# Altium schematic sheet Breakout.SchDoc
size A4; DocumentNumber: 1; SheetNumber: 1
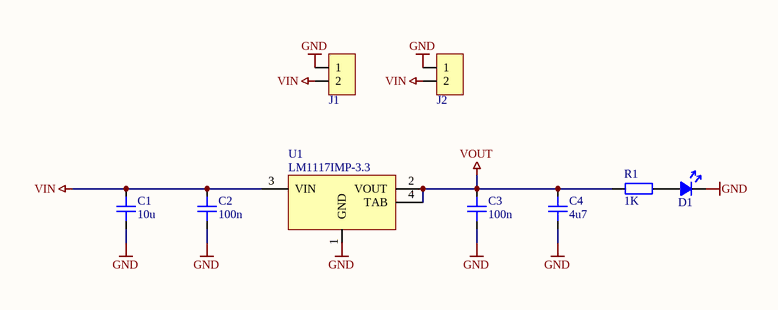
[diagram p0: Breakout.SchDoc]

## Parts
C1  10u  [0805C_RF_M]
C2  100n  [0805C_RF_M]
C3  100n  [0805C_RF_M]
C4  4u7  [0805C_RF_M]
D1  Unspecified  [0805LED_RF_M]  (value not drawn)
J1  PINHDR-2P1  [HEADER-2.54-2P1]  (value not drawn)
J2  PINHDR-2P1  [HEADER-2.54-2P1]  (value not drawn)
R1  1K  [0805R_RF_M]
U1  LM1117IMP-3.3  [SOT-223]

## Nets
GND: C1.1 C2.1 C3.1 C4.1 D1.C J1.1 J2.1 U1.1(GND)
VIN: C1.2 C2.2 J1.2 J2.2 U1.3(VIN)
VOUT: C3.2 C4.2 R1.1 U1.2(VOUT) U1.4(TAB)
NetD1_A: D1.A R1.2

## Notes on the sheet
- Author
- Date
- Revision
- Size
- A4
- Sheet
- of

## Library data of the parts
C1-C4 = C: Capacitor; Manufacturer: Generic Brand; Max Voltage: ? V; Tolerance: ?; Mounting Technology: SMT; Tag: *; Manufacturer Part No: *; Supplier: *; Supplier Link: http://; Supplier Part No: *; Category: Capacitor
  C1: Value: 10u
  C2 C3: Value: 100n
  C4: Value: 4u7
D1 = LED: Manufacturer: Generic Brand; Forward Voltage Drop: ? V; Emitting Color: Unspecified; Manufacturer Part No: *; Supplier: *; Supplier Link: http://; Supplier Part No: *; Category: Diode; Mounting Technology: SMT
J1 J2 = PINHDR-2P1: Pin Header Single Row 2 Positions; Mounting Technology: THT
R1 = R: Resistor; Manufacturer: Generic Brand; Power Rating: ? W; Max Voltage: ? V; Value: 1K; Tolerance: ?; Supplier Link: http://; Category: Resistor; Mounting Technology: SMT
U1 = LM1117: Voltage Regulator Linear 1% 800mA SOT-223; Manufacturer: Texas Instruments; VIN_MAX: +15V; VOUT: +3.3V; Case: SOT-223; Product Number: LM1117IMP-3.3; Supplier: Chipdip; Supplier Link: https://www.chipdip.by/product/lm1117imp-3.3-nopb-2; Supplier Part No: 5641124530; Mounting Type: SMT